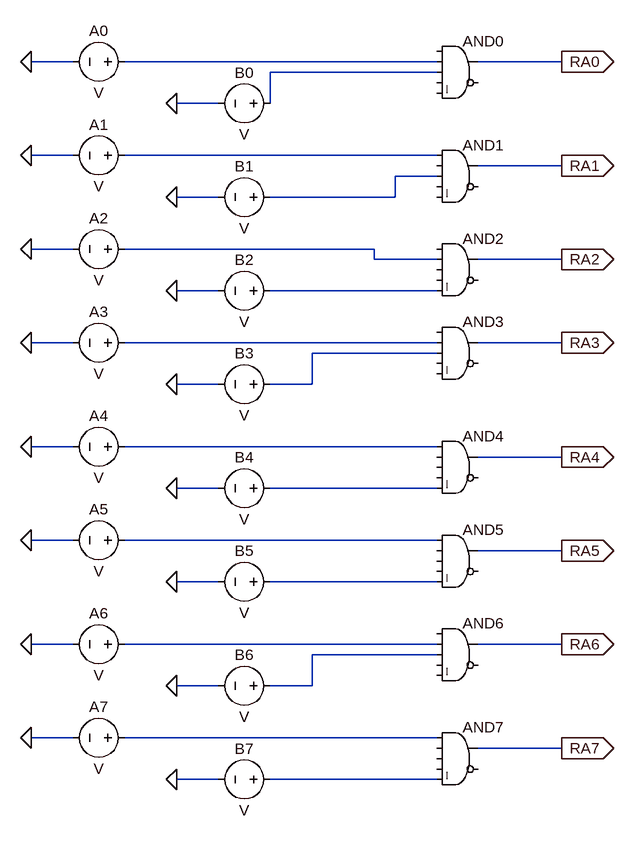
[diagram p0: schematic 8AND.asc]
8AND.asc, the LTspice schematic file:
Version 4.1
SHEET 1 892 1088
WIRE 32 -80 -32 -80
WIRE 592 -80 112 -80
WIRE 784 -80 656 -80
WIRE 592 -64 336 -64
WIRE 256 -16 192 -16
WIRE 336 -16 336 -64
WIRE 32 64 -32 64
WIRE 592 64 112 64
WIRE 784 80 656 80
WIRE 592 96 528 96
WIRE 256 128 192 128
WIRE 528 128 528 96
WIRE 528 128 336 128
WIRE 32 208 -32 208
WIRE 496 208 112 208
WIRE 496 224 496 208
WIRE 592 224 496 224
WIRE 784 224 656 224
WIRE 256 272 192 272
WIRE 592 272 336 272
WIRE 32 352 -32 352
WIRE 592 352 112 352
WIRE 784 352 656 352
WIRE 592 368 400 368
WIRE 256 416 192 416
WIRE 400 416 400 368
WIRE 400 416 336 416
WIRE 32 512 -32 512
WIRE 592 512 112 512
WIRE 784 528 656 528
WIRE 256 576 192 576
WIRE 592 576 336 576
WIRE 32 656 -32 656
WIRE 592 656 112 656
WIRE 784 672 656 672
WIRE 256 720 192 720
WIRE 592 720 336 720
WIRE 32 816 -32 816
WIRE 592 816 112 816
WIRE 784 816 656 816
WIRE 592 832 400 832
WIRE 256 880 192 880
WIRE 400 880 400 832
WIRE 400 880 336 880
WIRE 32 960 -32 960
WIRE 592 960 112 960
WIRE 784 976 656 976
WIRE 256 1024 192 1024
WIRE 592 1024 336 1024
FLAG -32 -80 0
FLAG -32 64 0
FLAG -32 208 0
FLAG -32 352 0
FLAG -32 512 0
FLAG -32 656 0
FLAG -32 816 0
FLAG -32 960 0
FLAG 192 -16 0
FLAG 192 128 0
FLAG 192 272 0
FLAG 192 416 0
FLAG 192 576 0
FLAG 192 720 0
FLAG 192 880 0
FLAG 192 1024 0
FLAG 784 -80 RA0
IOPIN 784 -80 Out
FLAG 784 80 RA1
IOPIN 784 80 Out
FLAG 784 224 RA2
IOPIN 784 224 Out
FLAG 784 352 RA3
IOPIN 784 352 Out
FLAG 784 528 RA4
IOPIN 784 528 Out
FLAG 784 672 RA5
IOPIN 784 672 Out
FLAG 784 816 RA6
IOPIN 784 816 Out
FLAG 784 976 RA7
IOPIN 784 976 Out
SYMBOL voltage 128 -80 R90
WINDOW 0 -32 56 VBottom 2
WINDOW 3 32 56 VTop 2
SYMATTR InstName A0
SYMBOL voltage 128 64 R90
WINDOW 0 -32 56 VBottom 2
WINDOW 3 32 56 VTop 2
SYMATTR InstName A1
SYMBOL voltage 128 208 R90
WINDOW 0 -32 56 VBottom 2
WINDOW 3 32 56 VTop 2
SYMATTR InstName A2
SYMBOL voltage 128 352 R90
WINDOW 0 -32 56 VBottom 2
WINDOW 3 32 56 VTop 2
SYMATTR InstName A3
SYMBOL voltage 128 512 R90
WINDOW 0 -32 56 VBottom 2
WINDOW 3 32 56 VTop 2
SYMATTR InstName A4
SYMBOL voltage 128 656 R90
WINDOW 0 -32 56 VBottom 2
WINDOW 3 32 56 VTop 2
SYMATTR InstName A5
SYMBOL voltage 128 816 R90
WINDOW 0 -32 56 VBottom 2
WINDOW 3 32 56 VTop 2
SYMATTR InstName A6
SYMBOL voltage 128 960 R90
WINDOW 0 -32 56 VBottom 2
WINDOW 3 32 56 VTop 2
SYMATTR InstName A7
SYMBOL voltage 352 -16 R90
WINDOW 0 -32 56 VBottom 2
WINDOW 3 32 56 VTop 2
SYMATTR InstName B0
SYMBOL voltage 352 128 R90
WINDOW 0 -32 56 VBottom 2
WINDOW 3 32 56 VTop 2
SYMATTR InstName B1
SYMBOL voltage 352 272 R90
WINDOW 0 -32 56 VBottom 2
WINDOW 3 32 56 VTop 2
SYMATTR InstName B2
SYMBOL voltage 352 416 R90
WINDOW 0 -32 56 VBottom 2
WINDOW 3 32 56 VTop 2
SYMATTR InstName B3
SYMBOL voltage 352 576 R90
WINDOW 0 -32 56 VBottom 2
WINDOW 3 32 56 VTop 2
SYMATTR InstName B4
SYMBOL voltage 352 720 R90
WINDOW 0 -32 56 VBottom 2
WINDOW 3 32 56 VTop 2
SYMATTR InstName B5
SYMBOL voltage 352 880 R90
WINDOW 0 -32 56 VBottom 2
WINDOW 3 32 56 VTop 2
SYMATTR InstName B6
SYMBOL voltage 352 1024 R90
WINDOW 0 -32 56 VBottom 2
WINDOW 3 32 56 VTop 2
SYMATTR InstName B7
SYMBOL Digital\\and 624 -128 R0
SYMATTR InstName AND0
SYMBOL Digital\\and 624 32 R0
SYMATTR InstName AND1
SYMBOL Digital\\and 624 176 R0
SYMATTR InstName AND2
SYMBOL Digital\\and 624 304 R0
SYMATTR InstName AND3
SYMBOL Digital\\and 624 480 R0
SYMATTR InstName AND4
SYMBOL Digital\\and 624 624 R0
SYMATTR InstName AND5
SYMBOL Digital\\and 624 768 R0
SYMATTR InstName AND6
SYMBOL Digital\\and 624 928 R0
SYMATTR InstName AND7

The netlist it stands for:
* 8AND.asc
V§A0 N001 0 V
V§A1 N003 0 V
V§A2 N005 0 V
V§A3 N007 0 V
V§A4 N009 0 V
V§A5 N011 0 V
V§A6 N013 0 V
V§A7 N015 0 V
V§B0 N002 0 V
V§B1 N004 0 V
V§B2 N006 0 V
V§B3 N008 0 V
V§B4 N010 0 V
V§B5 N012 0 V
V§B6 N014 0 V
V§B7 N016 0 V
AND0 0 N001 N002 0 0 0 RA0 0 AND
AND1 N003 0 N004 0 0 0 RA1 0 AND
AND2 0 N005 0 0 N006 0 RA2 0 AND
AND3 0 N007 N008 0 0 0 RA3 0 AND
AND4 N009 0 0 0 N010 0 RA4 0 AND
AND5 N011 0 0 0 N012 0 RA5 0 AND
AND6 0 N013 N014 0 0 0 RA6 0 AND
AND7 N015 0 0 0 N016 0 RA7 0 AND
.backanno
.end